# Altium schematic sheet H-00488 - Card Slot.SchDoc: Card Slot
size 403 x 281 mm; DocumentNumber: 8; SheetNumber: 8; SheetTotal: 12
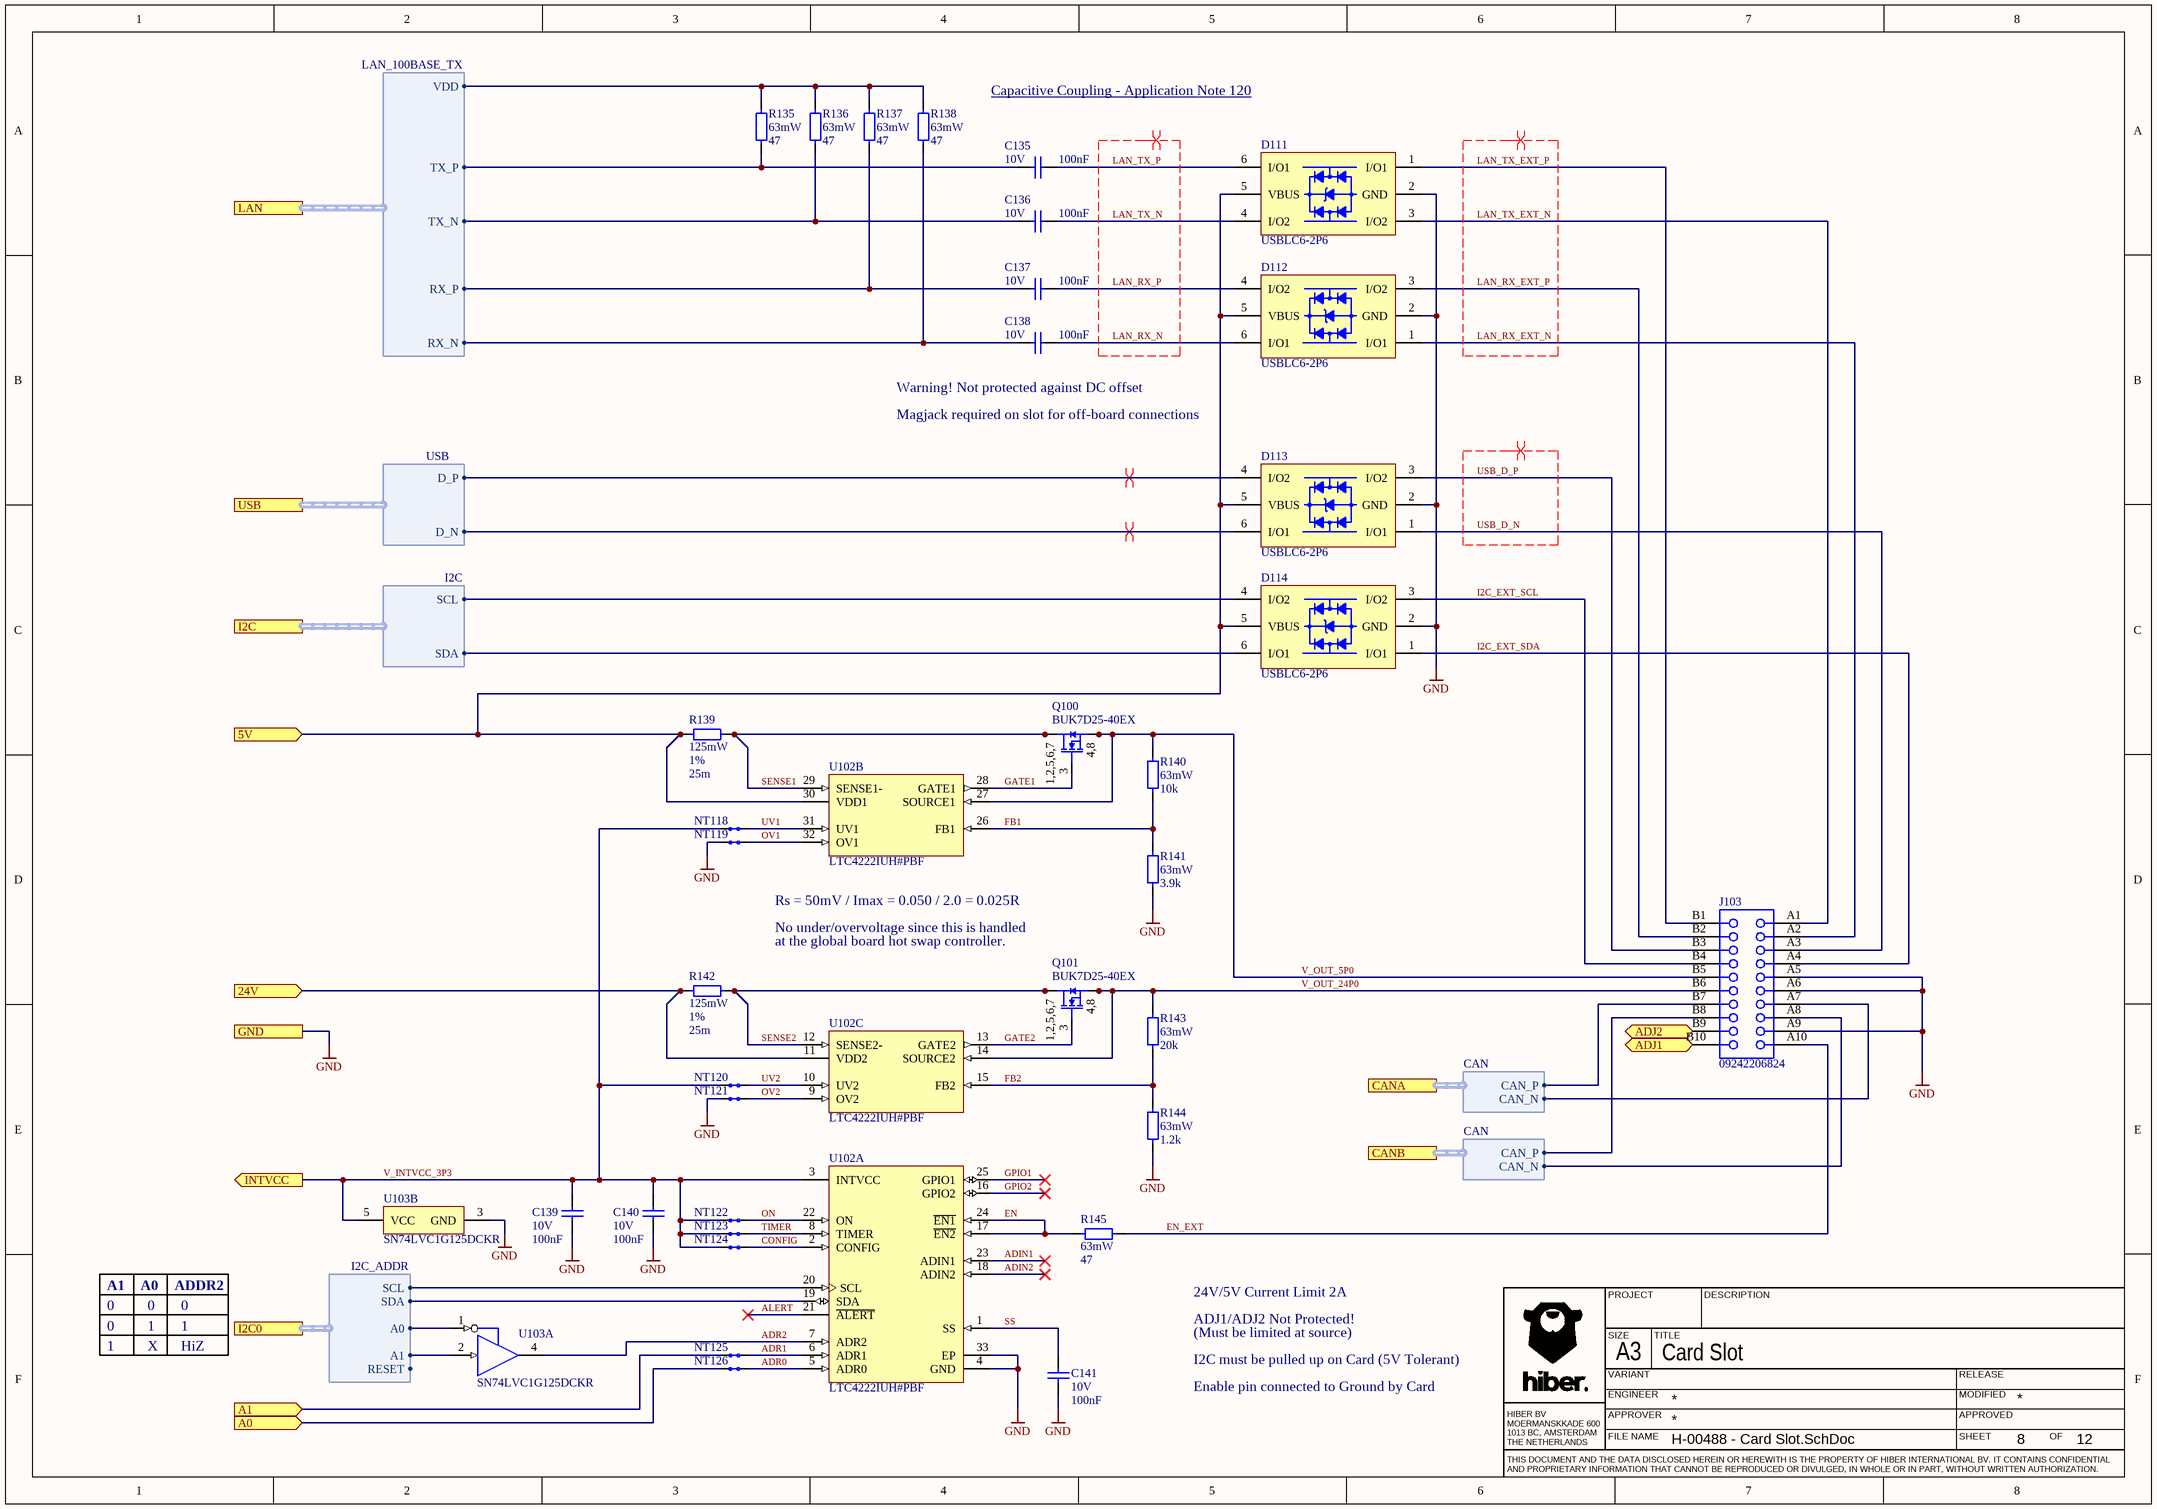
[diagram p0: H-00488 - Card Slot.SchDoc]

## Parts
C135  value 100nF  Rated Voltage: 10V  [CAPC100X50X55L30N]  (hidden comment: C0402C104K8RACTU)
C136  value 100nF  Rated Voltage: 10V  [CAPC100X50X55L30N]  (hidden comment: C0402C104K8RACTU)
C137  value 100nF  Rated Voltage: 10V  [CAPC100X50X55L30N]  (hidden comment: C0402C104K8RACTU)
C138  value 100nF  Rated Voltage: 10V  [CAPC100X50X55L30N]  (hidden comment: C0402C104K8RACTU)
C139  value 100nF  Rated Voltage: 10V  [CAPC100X50X55L30N]  (hidden comment: C0402C104K8RACTU)
C140  value 100nF  Rated Voltage: 10V  [CAPC100X50X55L30N]  (hidden comment: C0402C104K8RACTU)
C141  value 100nF  Rated Voltage: 10V  [CAPC100X50X55L30N]  (hidden comment: C0402C104K8RACTU)
D111  USBLC6-2P6  [DIOSOFL6P50_160X160X95L29X26]
D112  USBLC6-2P6  [DIOSOFL6P50_160X160X95L29X26]
D113  USBLC6-2P6  [DIOSOFL6P50_160X160X95L29X26]
D114  USBLC6-2P6  [DIOSOFL6P50_160X160X95L29X26]
J103  09242206824  [HARTING_09242206824]
NT118  NET-TIE  [NT200]  (value not drawn)  (net tie, no BOM)
NT119  NET-TIE  [NT200]  (value not drawn)  (net tie, no BOM)
NT120  NET-TIE  [NT200]  (value not drawn)  (net tie, no BOM)
NT121  NET-TIE  [NT200]  (value not drawn)  (net tie, no BOM)
NT122  NET-TIE  [NT200]  (value not drawn)  (net tie, no BOM)
NT123  NET-TIE  [NT200]  (value not drawn)  (net tie, no BOM)
NT124  NET-TIE  [NT200]  (value not drawn)  (net tie, no BOM)
NT125  NET-TIE  [NT200]  (value not drawn)  (net tie, no BOM)
NT126  NET-TIE  [NT200]  (value not drawn)  (net tie, no BOM)
Q100  BUK7D25-40EX  [NEXPERIA_SOT1220]
Q101  BUK7D25-40EX  [NEXPERIA_SOT1220]
R135  value 47  Rated Power: 63mW  [RESC100X50X40L25N]  (hidden comment: CRCW040247R0FKED)
R136  value 47  Rated Power: 63mW  [RESC100X50X40L25N]  (hidden comment: CRCW040247R0FKED)
R137  value 47  Rated Power: 63mW  [RESC100X50X40L25N]  (hidden comment: CRCW040247R0FKED)
R138  value 47  Rated Power: 63mW  [RESC100X50X40L25N]  (hidden comment: CRCW040247R0FKED)
R139  value 25m  Rated Power: 125mW  Tolerance: 1%  [RESC200X125X70L40N]  (hidden comment: WSL0805R0250FEA18)
R140  value 10k  Rated Power: 63mW  [RESC100X50X40L25N]  (hidden comment: CRCW040210K0FKED)
R141  value 3.9k  Rated Power: 63mW  [RESC100X50X40L25N]  (hidden comment: CRCW04023K90FKED)
R142  value 25m  Rated Power: 125mW  Tolerance: 1%  [RESC200X125X70L40N]  (hidden comment: WSL0805R0250FEA18)
R143  value 20k  Rated Power: 63mW  [RESC100X50X40L25N]  (hidden comment: CRCW040220K0FKED)
R144  value 1.2k  Rated Power: 63mW  [RESC100X50X40L25N]  (hidden comment: CRCW04021K20FKED)
R145  value 47  Rated Power: 63mW  [RESC100X50X40L25N]  (hidden comment: CRCW040247R0FKED)
U102  LTC4222IUH#PBF  [QFN33P50_500X500X80L40X25T345]  (parts A,B,C of 3)
U103  SN74LVC1G125DCKR  [SOT23-5P65_210X110L36X22]  (parts A,B of 2)

## Ports
5V (in), 24V (in), A0 (in), A1 (in), ADJ1 (bidir), ADJ2 (bidir), CANA (harness CAN), CANB (harness CAN), GND, I2C0 (harness I2C_ADDR), I2C (harness I2C), INTVCC (out), LAN (harness LAN_100BASE_TX), USB (harness USB)

## Harnesses
CAN: CAN_N, CAN_P
I2C: SCL, SDA
I2C_ADDR: SDA, SCL, A0, A1, RESET
LAN_100BASE_TX: RX_N, RX_P, TX_P, TX_N, VDD
USB: D_P, D_N

## Nets
GND: C139.2 C140.2 C141.2 D111.2(GND) D112.2(GND) D113.2(GND) D114.2(GND) J103.A5 J103.A6 J103.A9 NT119.1 NT121.1 R141.2 R144.2 U102.4(GND) U102.33(EP) U103.3(GND) ; port GND
5V: D111.5(VBUS) D112.5(VBUS) D113.5(VBUS) D114.5(VBUS) R139.2 U102.30(VDD1) ; port 5V
24V: R142.2 U102.11(VDD2) ; port 24V
A0: NT126.1 ; port A0
A1: NT125.1 ; port A1
ADIN1: U102.23(ADIN1)
ADIN2: U102.18(ADIN2)
ADJ1: J103.B10 ; port ADJ1
ADJ2: J103.B9 ; port ADJ2
ADR0: NT126.2 U102.5(ADR0)
ADR1: NT125.2 U102.6(ADR1)
ADR2: U102.7(ADR2) U103.4(Y)
ALERT: U102.21(~{ALERT})
CONFIG: NT124.2 U102.2(CONFIG)
EN: R145.1 U102.17(~{EN2}) U102.24(~{EN1})
EN_EXT: J103.A10 R145.2
FB1: R140.2 R141.1 U102.26(FB1)
FB2: R143.2 R144.1 U102.15(FB2)
GATE1: Q100.3(G) U102.28(GATE1)
GATE2: Q101.3(G) U102.13(GATE2)
GPIO1: U102.25(GPIO1)
GPIO2: U102.16(GPIO2)
I2C_EXT_SCL: D114.3(I/O2) J103.B4
I2C_EXT_SDA: D114.1(I/O1) J103.A4
LAN_RX_EXT_N: D112.1(I/O1) J103.A2
LAN_RX_EXT_P: D112.3(I/O2) J103.B2
LAN_RX_N: C138.2 D112.6(I/O1)
LAN_RX_P: C137.2 D112.4(I/O2)
LAN_TX_EXT_N: D111.3(I/O2) J103.A1
LAN_TX_EXT_P: D111.1(I/O1) J103.B1
LAN_TX_N: C136.2 D111.4(I/O2)
LAN_TX_P: C135.2 D111.6(I/O1)
ON: NT122.2 U102.22(ON)
OV1: NT119.2 U102.32(OV1)
OV2: NT121.2 U102.9(OV2)
SENSE1: Q100.1(D) Q100.2(D) Q100.5(D) Q100.6(D) Q100.7(D) R139.1 U102.29(SENSE1-)
SENSE2: Q101.1(D) Q101.2(D) Q101.5(D) Q101.6(D) Q101.7(D) R142.1 U102.12(SENSE2-)
SS: C141.1 U102.1(SS)
TIMER: NT123.2 U102.8(TIMER)
USB_D_N: D113.1(I/O1) J103.A3
USB_D_P: D113.3(I/O2) J103.B3
UV1: NT118.2 U102.31(UV1)
UV2: NT120.2 U102.10(UV2)
V_INTVCC_3P3: C139.1 C140.1 NT118.1 NT120.1 NT122.1 NT123.1 NT124.1 U102.3(INTVCC) U103.5(VCC) ; port INTVCC
V_OUT_5P0: J103.B5 Q100.4(S) Q100.8(S) R140.1 U102.27(SOURCE1)
V_OUT_24P0: J103.B6 Q101.4(S) Q101.8(S) R143.1 U102.14(SOURCE2)
NetC135_1: C135.1 R135.1 ; port LAN.TX_P
NetC136_1: C136.1 R136.1 ; port LAN.TX_N
NetC137_1: C137.1 R137.1 ; port LAN.RX_P
NetC138_1: C138.1 R138.1 ; port LAN.RX_N
NetD113_4: D113.4(I/O2) ; port USB.D_P
NetD113_6: D113.6(I/O1) ; port USB.D_N
NetD114_4: D114.4(I/O2) ; port I2C.SCL
NetD114_6: D114.6(I/O1) ; port I2C.SDA
NetJ103_A7: J103.A7 ; port CANA.CAN_N
NetJ103_A8: J103.A8 ; port CANB.CAN_N
NetJ103_B7: J103.B7 ; port CANA.CAN_P
NetJ103_B8: J103.B8 ; port CANB.CAN_P
NetR135_2: R135.2 R136.2 R137.2 R138.2 ; port LAN.VDD
NetU102_19: U102.19(SDA) ; port I2C0.SDA
NetU102_20: U102.20(SCL) ; port I2C0.SCL
NetU103_1: U103.1(~{OE}) ; port I2C0.A0
NetU103_2: U103.2(A) ; port I2C0.A1

## Layout directives
differential pair; differential pair class DIFF_LAN: LAN_RX_EXT_N, LAN_RX_EXT_P, LAN_RX_N, LAN_RX_P, LAN_TX_EXT_N, LAN_TX_EXT_P, LAN_TX_N, LAN_TX_P
differential pair; differential pair class DIFF_USB: NetD113_4, NetD113_6, USB_D_N, USB_D_P

## Notes on the sheet
- Capacitive Coupling - Application Note 120 <http://ww1.microchip.com/downloads/en/AppNotes/Capacitive%20Coupling%20Ethernet%20Transceivers%20without%20Using%20Transformers.pdf>
- (near C138) Warning! Not protected against DC offset
- Magjack required on slot for off-board connections
- Rs = 50mV / Imax = 0.050 / 2.0 = 0.025R
- No under/overvoltage since this is handled
- (near Q101) at the global board hot swap controller.
- A1
- 0
- A0
- ADDR2
- 24V/5V Current Limit 2A
- ADJ1/ADJ2 Not Protected!
- 1
- X
- HiZ
- I2C must be pulled up on Card (5V Tolerant)
- Enable pin connected to Ground by Card
- (Must be limited at source)
- PROJECT
- DESCRIPTION
- SIZE
- ENGINEER
- VARIANT
- A3
- TITLE
- MODIFIED
- RELEASE
- HIBER BV
  MOERMANSKKADE 600
  1013 BC, AMSTERDAM
  THE NETHERLANDS
- FILE NAME
- APPROVER
- SHEET
- APPROVED
- OF
- THIS DOCUMENT AND THE DATA DISCLOSED HEREIN OR HEREWITH IS THE PROPERTY OF HIBER INTERNATIONAL BV. IT CONTAINS CONFIDENTIAL AND PROPRIETARY INFORMATION THAT CANNOT BE REPRODUCED OR DIVULGED, IN WHOLE OR IN PART, WITHOUT WRITTEN AUTHORIZATION.
- (in symbol CMP-01110-3) 1,2,5,6,7; 4,8

## Library data of the parts
C135-C141 = CMP-00367-3: CAP Standard 0402 (1005) 100,0nF 10V X7R (Standard); Type: Ceramic; Tolerance: 10%; Termination Finish: 100% Matte Sn; Qualification: Standard; RoHS: Yes; Mount: SMT; Case/Package: 0402 (1005); Failure Rate: N/A; Pins: 2; Dielectric: X7R
D111-D114 = CMP-00780-2: TVS DIODE 5.25VWM 17VC SOT666; Reverse Breakdown Voltage: 6V; ESD Protection: Yes; Max Reverse Leakage Current: 150nA; Number of Elements: 1; Clamping Voltage: 17V; Direction: Bidirectional, Unidirectional; Capacitance: 3.5pF; Working Voltage: 5V; Number of Channels: 2; Test Current: 1mA; Peak Pulse Current: 5A; Element Configuration: Dual; Qualification: Standard; Max Operating Temperature: 125°C; Lead Free: Lead Free; Contact Plating: Matte, Tin; Package Quantity: 1; Case/Package: SOT-666; Min Operating Temperature: -40°C; Length: 1.7mm; Breakdown Voltage: 6V; Packaging: Tape and Reel; REACH SVHC: No SVHC; Termination: SMD/SMT; Mount: Surface Mount; Power Line Protection: Yes; Radiation Hardening: No; RoHS: Yes; Leakage Current: 150nA; Polarity: Bidirectional, Unidirectional; Depth: 1.3mm; Number of Bidirectional Channels: 2; Number of Pins: 6; Height: 0.6mm; Reverse Standoff Voltage: 5V; Width: 1.3mm; Min Breakdown Voltage: 6V; Operating Supply Voltage: 5V; Max Breakdown Voltage: 6V
J103 = CMP-01077-1: Board Euro Connector; RoHS: Yes; Mount: TH; Connector Type: BOARD EURO CONNECTOR
NT118-NT126 = CMP-00523-9: Net Tie, Inline
Q100 Q101 = CMP-01110-3: BUK7D25 Series 40V Surface-Mounted N-channel Trench MOSFET - SOT1118; Qualification: Standard; Mount: Surface-Mount; Case/Package: SOT1220; RoHS: Yes
R135-R138 R145 = CMP-00238-8: RES Standard Thick Film 0402 47R0 ±1% 0,063W; Qualification: Automotive; Rated Voltage: 50V; Mount: Surface Mount; Termination Finish: Pure tin solder contacts on Ni barrier layer; Case/Package: 0402 (1005); Pins: 2; Tolerance: 1%; Failure Rate: N/A; Type: Standard Thick Film; RoHS: Yes
R139 R142 = CMP-01104-2: RES Power Metal Strip 0805 0R025 ±1% 0,125W; Qualification: Automotive; Case/Package: 0805(2012); RoHS: Yes; Pins: 2; Type: Power Metal Strip; Mount: Surface Mount
R140 = CMP-00294-7: RES Standard Thick Film 0402 10K0 ±1% 0,063W; Qualification: Automotive; Rated Voltage: 50V; Mount: Surface Mount; Termination Finish: Pure tin solder contacts on Ni barrier layer; Case/Package: 0402 (1005); Pins: 2; Tolerance: 1%; Failure Rate: N/A; Type: Standard Thick Film; RoHS: Yes
R141 = CMP-00284-8: RES Standard Thick Film 0402 3K90 ±1% 0,063W; Qualification: Automotive; Rated Voltage: 50V; Mount: Surface Mount; Termination Finish: Pure tin solder contacts on Ni barrier layer; Case/Package: 0402 (1005); Pins: 2; Tolerance: 1%; Failure Rate: N/A; Type: Standard Thick Film; RoHS: Yes
R143 = CMP-00301-7: RES Standard Thick Film 0402 20K0 ±1% 0,063W; Qualification: Automotive; Rated Voltage: 50V; Mount: Surface Mount; Termination Finish: Pure tin solder contacts on Ni barrier layer; Case/Package: 0402 (1005); Pins: 2; Tolerance: 1%; Failure Rate: N/A; Type: Standard Thick Film; RoHS: Yes
R144 = CMP-00272-8: RES Standard Thick Film 0402 1K20 ±1% 0,063W; Qualification: Automotive; Rated Voltage: 50V; Mount: Surface Mount; Termination Finish: Pure tin solder contacts on Ni barrier layer; Case/Package: 0402 (1005); Pins: 2; Tolerance: 1%; Failure Rate: N/A; Type: Standard Thick Film; RoHS: Yes
U102 = CMP-01087-7: Power Supply Support Circuit, Adjustable, 2 Channel, CMOS, PQCC32; Adjustable Threshold: Yes; Supply Voltage-Min (Vsup): 2.9V; Supply Voltage-Nom (Vsup): 12V; Number of Channels: 2; Time @ Peak Reflow Temperature-Max (s): 30s; Number of Functions: 1; Supply Voltage-Max (Vsup): 29V; Package Body Material: Plastic; Qualification Status: Not Qualified; Package Style: CHIP CARRIER, HEAT SINK/SLUG, VERY THIN PROFILEMeter; Terminal Pitch: 0.5mm; Moisture Sensitivity Level: 1; Width: 5mm; Surface Mount: Yes; Terminal Position: QUAD; Terminal Finish: Tin; Terminal Form: No Lead; Analog IC - Other Type: POWER SUPPLY SUPPORT CIRCUIT; Max Operating Temperature: 85°C; Package Shape: Square; Height - Seated (Max): 0.8mm; JESD-30 Code: S-PQCC-N32; JESD-609 Code: e3; Temperature Grade: INDUSTRIAL; Peak Reflow Temperature (Cel): 260°C; Min Operating Temperature: -40°C; Number of Pins: 32; Package Code: HVQCCN; Length: 5mm
U103 = CMP-01092-2: Bus Driver, LVC/LCX/Z Series, 1-Func, 1-Bit, True Output, CMOS, PDSO5; Output Characteristics: 3-STATE; Supply Voltage-Min (Vsup): 1.65V; Number of Functions: 1; Max I(ol): 24mA; Supply Voltage-Max (Vsup): 5.5V; Number of Ports: 2; Qualification Status: Not Qualified; Load/Preset Input: Yes; Propagation Delay (tpd): 9ns; Package Body Material: Plastic; Load Capacitance (CL): 50pF; Package Equivalence Code: TSSOP5/6,.08; Prop. Delay@Nom-Sup: 4.5ns; Power Supplies: 3.3V; Control Type: ENABLE LOW; Height - Seated (Max): 1.1mm; Peak Reflow Temperature (Cel): 260°C; Surface Mount: Yes; Packaging: Tape and Reel; Logic IC Type: BUS DRIVER; Technology: CMOS; JESD-609 Code: e4; Max Operating Temperature: 125°C; Length: 2mm; Temperature Grade: AUTOMOTIVE; Min Operating Temperature: -40°C; Number of Bits: 1; Terminal Finish: Nickel; Package Code: TSSOP; JESD-30 Code: R-PDSO-G5; Package Shape: Rectangular; Number of Pins: 5; Package Style: SMALL OUTLINE, THIN PROFILE, SHRINK PITCHMeter; Output Polarity: True; Moisture Sensitivity Level: 1; Width: 1.25mm; Terminal Form: Gull Wing; Terminal Position: DUAL; Terminal Pitch: 0.65mm; Supply Voltage-Nom (Vsup): 3.3V